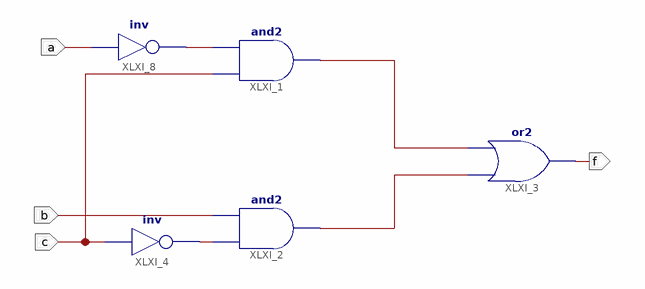
[diagram p0: schematic sheet 1]
// Xilinx ISE schematic schema.sch (spartan3e) as structural Verilog: 5 symbols, 4 ports
module schema (
  input  c,
  input  b,
  input  a,
  output f
);

  wire XLXN_1, XLXN_2, XLXN_4, XLXN_9;

  and XLXI_1 (XLXN_1, c, XLXN_9);
  and XLXI_2 (XLXN_2, XLXN_4, b);
  or XLXI_3 (f, XLXN_2, XLXN_1);
  not XLXI_4 (XLXN_4, c);
  not XLXI_8 (XLXN_9, a);
endmodule
